# Altium project PCB_Project.PrjPcb (part 4 of 4)

## Sheet USB.SchDoc
size 420 x 297 mm; Date: 22.03.2024; ApprovedBy: Arda B.; CheckedBy: Arda B.; DrawnBy: Arda Bozkurt; Revision: 001; SheetNumber: 9; SheetTotal: 9; Size: A3; Department: HDD; DOC_NO_ASSY_: __; Time: 22.03.2024
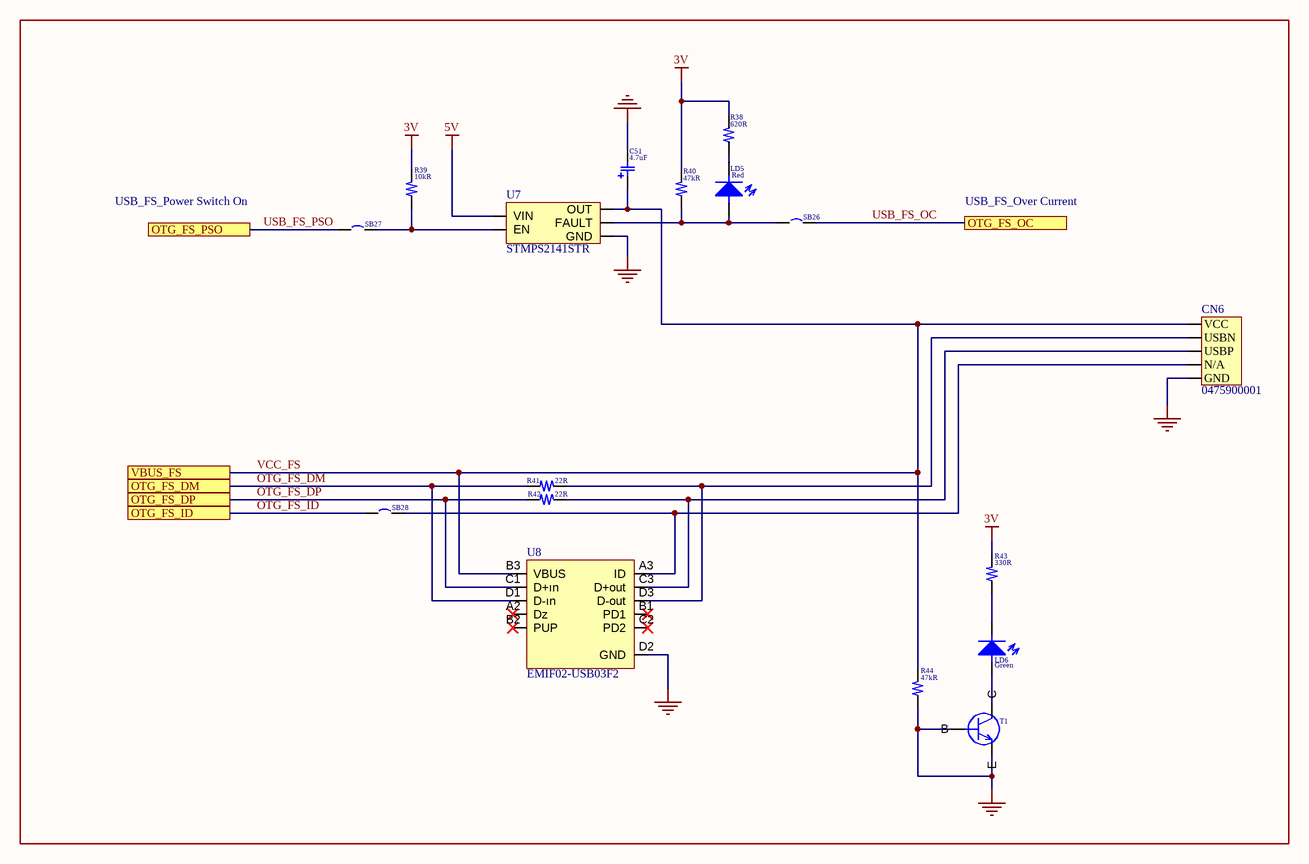
[diagram p8: USB.SchDoc]

### Parts
C51  value 4.7uF  [CAP-TANT]  (hidden comment: TCJK475M010R0300)
CN6  0475900001  [USB MİCRO A]
LD5  Color: Red  [LED-RED-0603]  (hidden comment: 150060RS75000)
LD6  Color: Green  [LED-GREEN-0603]  (hidden comment: 150060VS75000)
R38  value 620R  [RES-0603]  (hidden comment: RC0603FR-07620RL)
R39  value 10kR  [RES-0402]  (hidden comment: RC0402FR-0710KL)
R40  value 47kR  [RES-0402]  (hidden comment: RC0402FR-0747KL)
R41  value 22R  [RES-0603]  (hidden comment: RC0603FR-0722RL)
R42  value 22R  [RES-0603]  (hidden comment: RC0603FR-0722RL)
R43  value 330R  [RES-0402]  (hidden comment: RC0402FR-07330RL)
R44  value 47kR  [RES-0402]  (hidden comment: RC0402FR-0747KL)
SB26  RC0402JR-070RL  [RES-0402]  (value not drawn)
SB27  RC0402JR-070RL  [RES-0402]  (value not drawn)
SB28  RC0402JR-070RL  [RES-0402]  (value not drawn)
T1  MMBT2222ALT1G  [SOT23-3]  (value not drawn)
U7  STMPS2141STR  [SOT23-5L]
U8  EMIF02-USB03F2  [Flip-Chip-11]

### Ports
OTG_FS_DM (see TOP[5B], Micro Controller[5B]), OTG_FS_DP (see TOP[5B], Micro Controller[5B]), OTG_FS_ID (see TOP[5B], Micro Controller[5B]), OTG_FS_OC (see TOP[6B], Micro Controller[5B]), OTG_FS_PSO (see TOP[6B], Micro Controller[5B]), VBUS_FS (see TOP[5B], Micro Controller[5B])

### Nets
3V: R38.2 R39.2 R40.2 R43.2
5V: U7.5(VIN)
GND: C51.2 CN6.5(GND) R44.1 T1.1(B) T1.2(E) U7.2(GND) U8.D2(GND)
OTG_FS_DM: R41.1 U8.D1(D-ın) ; port OTG_FS_DM
OTG_FS_DP: R42.1 U8.C1(D+ın) ; port OTG_FS_DP
OTG_FS_ID: SB28.1 ; port OTG_FS_ID
USB_FS_OC: SB26.2 ; port OTG_FS_OC  [project net OTG_FS_OC]
USB_FS_PSO: SB27.1 ; port OTG_FS_PSO  [project net OTG_FS_PSO]
VCC_FS: C51.1 CN6.1(VCC) R44.2 U7.1(OUT) U8.B3(VBUS) ; port VBUS_FS  [project net PB13]
NetCN6_2: CN6.2(USBN) R41.2 U8.D3(D-out)
NetCN6_3: CN6.3(USBP) R42.2 U8.C3(D+out)
NetCN6_4: CN6.4(N/A) SB28.2 U8.A3(ID)
NetLD5_1: LD5.1 R38.1
NetLD5_2: LD5.2 R40.1 SB26.1 U7.3(FAULT)
NetLD6_1: LD6.1 R43.1
NetLD6_2: LD6.2 T1.3(C)
NetR39_1: R39.1 SB27.2 U7.4(EN)

Not connected (* = marked no-connect by the designer): U8 A2(Dz)* B1(PD1)* B2(PUP)* C2(PD2)*

### Notes on the sheet
- USB_FS_Power Switch On
- USB_FS_Over Current
- REVİSİON
- DESCRIPTION
- DATE
- APPROVED
- DWG NO:
- TAINIM/DESCRIPTION
- REV:
- DOSYA ADI/FİLE NAME
- HAZIRLAYAN/PREPARED BY
- KONTROL EDEN/ CHECKED BY
- YAYIN TARİHİ/REL. DATE
- DEĞ TARİHİ/CHANCE DATE
- ONAYLAYAN/APPROVED BY
- REVİZYON/REVISION
- Arda Bozkurt
- BÖLÜM/DEPARTMENT
- BOYUT/SİZE
- SAYFA/SHEET
- of

### Library data of the parts
C51 = C-TANT POLY 4.7UF 10V 1206: Cap Tant Polymer 4.7uF 10V K CASE 20% (3.2 x 1.6 x 1mm) SMD 300m Ohm 105°C T/R; Manufacturer: Kyocera AVX; Manufacturer Part Number: TCJK475M010R0300E; Supplier: Avnet; Supplier Part Number: TCJK475M010R0300E; RoHS: Yes; Pricing: 3000=0,72395 (USD)
CN6 = CONN USB MİCRO A 5P: USB Connector, 5 Contact(s), Female, Right Angle, Surface Mount Terminal, Locking, Receptacle; Manufacturer: Molex; Manufacturer Part Number: 47590-0001; Plating: 157ConductorMaterial; Supplier: Mouser; Supplier Part Number: 538-47590-0001; RoHS: Yes; Category: USB Connectors; Stock: 13739; Pricing: 1=0,79, 10=0,699, 50=0,699, 100=0,582, 1000=0,53, 10000=0,421 (USD)
LD5 = LED RED CLEAR 0603 SMD: LED Low-Power Uni-Color Red 630nm 2V 2-Pin Chip 0603(1608Metric) T/R; Manufacturer: Wurth Electronics; Lens Color: Colorless; Viewing Angle: 140°; Lens Style: Clear,Flat,Rectangular; Luminous Intensity: 250mcd; Forward Current: 30mA; Wavelength: 625nm; Test Current: 20mA; Lens Transparency: Clear; Max Reverse Voltage (DC): 5V; Power Dissipation: 72mW; Lens Size: 0.7mm; Supplier: Farnell; Supplier Part Number: 2322071; Manufacturer Part Number: 150060RS75000; RoHS: Yes; Category: LEDs; Stock: 28909; Pricing: 5=0,164, 10=0,147, 100=0,121, 500=0,11, 1000=0,108 (EUR); Mounting Technology: Surface Mount; Case/Package: 0603; Case Code (Metric): 1608; Case Code (Imperial): 0603; Min Operating Temperature: -40°C; Max Operating Temperature: 85°C; Package Quantity: 1; Packaging: Cut Tape; Forward Voltage: 2V; Dominant Wavelength: 625nm; Series: WL-SMCW; Reverse Voltage: 5V; Length: 1.6mm; Width: 0.8mm; Height: 0.8mm; RoHS Compliant: Yes; Reach SVHC Compliant: Unknown; ComponentLink1URL: https://datasheet.ciiva.com/29563/150060rs75000-29563040.pdf?src-supplier=Digikey; ComponentLink1Description: https://datasheet.ciiva.com/29563/150060rs75000-29563040.pdf?src-supplier=Digikey; ComponentLink2URL: https://datasheet.ciiva.com/29279/759428-da-01-en-chipled-0603-w-kl-rot-150060rs75000-29279196.pdf?src-supplier=Conrad; ComponentLink2Description: https://datasheet.ciiva.com/29279/759428-da-01-en-chipled-0603-w-kl-rot-150060rs75000-29279196.pdf?src-supplier=Conrad
LD6 = LED GREEN CLEAR 0603 SMD: WURTH ELEKTRONIK - 150060VS75000 - LED, Green, SMD, 0603, 30 mA, 2 V, 570 nm; Manufacturer: Wurth Electronics; Lens Color: Colorless; Luminous Intensity: 40mcd; Viewing Angle: 140°; Forward Voltage: 2V; Lens Style: Rectangular,Flat; Forward Current: 20mA; Dominant Wavelength: 570nm; Lens Transparency: Clear; Power Rating: 72mW; Reverse Voltage (DC): 5V; Lens Size: 0.7mm; Supplier: Farnell; Supplier Part Number: 2322073; Manufacturer Part Number: 150060VS75000; RoHS: Yes; Category: LEDs; Stock: 2968; Pricing: 5=0,164, 10=0,147, 100=0,121, 500=0,11, 1000=0,108 (EUR); Mounting Technology: Surface Mount; Case/Package: 0603; Pins: 2; Case Code (Metric): 1608; Case Code (Imperial): 0603; Weight: 0.000882oz; Min Operating Temperature: -40°C; Max Operating Temperature: 85°C; Package Quantity: 4000; Packaging: Cut Tape; Test Current: 20mA; Illumination Color: Green; Series: WL-SMCW; Max Reverse Voltage (DC): 5V; Power Dissipation: 72mW; Reverse Voltage: 5V; Length: 1.6mm; Width: 0.8mm; Height: 0.8mm; RoHS Compliant: Yes; Reach SVHC Compliant: 4187SVHC; ComponentLink1URL: https://datasheet.ciiva.com/29562/150060vs75000-29562919.pdf?src-supplier=Digikey; ComponentLink1Description: https://datasheet.ciiva.com/29562/150060vs75000-29562919.pdf?src-supplier=Digikey
R38 = RES 620 OHM 1% 1/10W 0603: SMD Chip Resistor, 620 Ohm, ± 1%, 100 mW, 0603 [1608 Metric], Thick Film, General Purpose; Manufacturer: Yageo; Supplier: Future Electronics; Supplier Part Number: 6944821; Manufacturer Part Number: RC0603FR-07620RL; RoHS: Yes; Category: Chip SMD Resistors; Stock: 330000; Pricing: 5000=0,0015, 50000=0,0014, 150000=0,0014, 375000=0,0013, 1000000=0,0012 (USD); ComponentLink1URL: http://www.mouser.com/ds/2/447/RC0603-272842.pdf?src-supplier=Mouser; ComponentLink1Description: http://www.mouser.com/ds/2/447/RC0603-272842.pdf?src-supplier=Mouser; ComponentLink2URL: http://www.yageo.com/documents/recent/PYu-RC_Group_51_RoHS_L_9.pdf?src-supplier=Digikey; ComponentLink2Description: http://www.yageo.com/documents/recent/PYu-RC_Group_51_RoHS_L_9.pdf?src-supplier=Digikey; ComponentLink3URL: http://www.yageo.com/documents/recent/PYu-RC_Group_51_RoHS_L_10.pdf?src-supplier=Digikey; ComponentLink3Description: http://www.yageo.com/documents/recent/PYu-RC_Group_51_RoHS_L_10.pdf?src-supplier=Digikey; ComponentLink4URL: https://datasheet.octopart.com/RC0603FR-07620RL-Yageo-datasheet-164759695.pdf?src-supplier=Future+Electronics; ComponentLink4Description: https://datasheet.octopart.com/RC0603FR-07620RL-Yageo-datasheet-164759695.pdf?src-supplier=Future+Electronics; ComponentLink5URL: http://www.yageo.com/documents/recent/PYu-RC0603_51_RoHS_L_7.pdf?src-supplier=Future+Electronics; ComponentLink5Description: http://www.yageo.com/documents/recent/PYu-RC0603_51_RoHS_L_7.pdf?src-supplier=Future+Electronics; ComponentLink6URL: https://datasheet.octopart.com/RC0603FR-07620RL-Yageo-datasheet-148775077.pdf?src-supplier=TME; ComponentLink6Description: https://datasheet.octopart.com/RC0603FR-07620RL-Yageo-datasheet-148775077.pdf?src-supplier=TME
R39 = RES 10K OHM 1% 1/16W 0402: SMD Chip Resistor, 10 kOhm, ± 1%, 63 mW, 0402 [1005 Metric], Thick Film, General Purpose; Manufacturer: Yageo; Voltage Rating (DC): 50V; Temperature Coefficient: 100ppm/°C; Power Rating: 62.5mW; Max Power Dissipation: 63mW; Supplier: Future Electronics; Supplier Part Number: 3388022; Manufacturer Part Number: RC0402FR-0710KL; RoHS: Yes; Category: Chip SMD Resistors; Stock: 56000000; Pricing: 10000=0,0012, 100000=0,0011, 300000=0,001, 750000=0,001, 2000000=0,0009 (USD); Case/Package: 0402; Pins: 2; Case Code (Imperial): 0402; Case Code (Metric): 1005; Min Operating Temperature: -55°C; Max Operating Temperature: 155°C; Resistor Type: Thick Film; Voltage Rating: 50V; Tolerance: 1%; Packaging: Tape and Reel; Termination: SMD/SMT; Series: RC; Number of Terminations: 2; Features: Moisture Resistant; Resistance Tolerance: 1%; Construction: Rectangular; Length: 1mm; Width: 0.5mm; Depth: 0.5mm; Lead Pitch: 0.2mm; RoHS Compliant: Yes; Reach SVHC Compliant: Unknown; Lead Free: 5697LeadFree; Military Standard: Not; ComponentLink1URL: https://datasheet.ciiva.com/7660/38568-7660787.pdf?src-supplier=Element14; ComponentLink1Description: https://datasheet.ciiva.com/7660/38568-7660787.pdf?src-supplier=Element14; ComponentLink2URL: https://datasheet.ciiva.com/7849/1686128-7849814.pdf?src-supplier=Element14; ComponentLink2Description: https://datasheet.ciiva.com/7849/1686128-7849814.pdf?src-supplier=Element14; ComponentLink3URL: https://datasheet.ciiva.com/7983/1018594-7983486.pdf?src-supplier=Element14; ComponentLink3Description: https://datasheet.ciiva.com/7983/1018594-7983486.pdf?src-supplier=Element14
R40 R44 = RES 47K OHM 1% 1/16W 0402: SMD Chip Resistor, 47 kOhm, ± 1%, 63 mW, 0402 [1005 Metric], Thick Film, General Purpose; Manufacturer: Yageo; Power Rating: 62.5mW; Temperature Coefficient: 100ppm/°C; Voltage Rating: 50V; Max Power Dissipation: 63mW; Supplier: Future Electronics; Supplier Part Number: 6020820; Manufacturer Part Number: RC0402FR-0747KL; RoHS: Yes; Category: Chip SMD Resistors; Stock: 1220000; Pricing: 10000=0,0019, 100000=0,0011, 200000=0,0018, 300000=0,001, 750000=0,0017, 2000000=0,0017, 7500000=0,0015 (USD); Case/Package: 0402; Case Code (Imperial): 0402; Case Code (Metric): 1005; Min Operating Temperature: -55°C; Max Operating Temperature: 155°C; Tolerance: 1%; Series: RC; Packaging: Tape and Reel; Package Quantity: 1; Termination: SMD/SMT; Resistor Type: Thick Film; Number of Terminations: 2; Features: Moisture Resistant; Resistance Tolerance: 1%; Construction: Rectangular; Voltage Rating (AC): 50V; Length: 1mm; Width: 0.02inch; Height: 0.016inch; Depth: 0.5mm; RoHS Compliant: Yes; Military Standard: Not; Reach SVHC Compliant: Unknown; Lead Free: 5697LeadFree; ComponentLink1URL: https://datasheet.ciiva.com/46412/1018594-46412839.pdf?src-supplier=Element14; ComponentLink1Description: https://datasheet.ciiva.com/46412/1018594-46412839.pdf?src-supplier=Element14; ComponentLink2URL: https://datasheet.ciiva.com/2453/pyu-r-int-thick-7-2453389.pdf?src-supplier=Digikey; ComponentLink2Description: https://datasheet.ciiva.com/2453/pyu-r-int-thick-7-2453389.pdf?src-supplier=Digikey; ComponentLink3URL: https://datasheet.ciiva.com/2453/pyu-r-int-thick-7-2453390.pdf?src-supplier=Digikey; ComponentLink3Description: https://datasheet.ciiva.com/2453/pyu-r-int-thick-7-2453390.pdf?src-supplier=Digikey; ComponentLink4URL: https://datasheet.ciiva.com/2453/pyu-r-int-thick-7-2453388.pdf?src-supplier=Digikey; ComponentLink4Description: https://datasheet.ciiva.com/2453/pyu-r-int-thick-7-2453388.pdf?src-supplier=Digikey; ComponentLink5URL: https://datasheet.ciiva.com/15189/getdatasheetpartid-323748-15189466.pdf?src-supplier=Verical; ComponentLink5Description: https://datasheet.ciiva.com/15189/getdatasheetpartid-323748-15189466.pdf?src-supplier=Verical; ComponentLink6URL: https://datasheet.ciiva.com/16793/pyu-rc0402-51-rohs-l-6-r-16793430.pdf?src-supplier=Future+Electronics; ComponentLink6Description: https://datasheet.ciiva.com/16793/pyu-rc0402-51-rohs-l-6-r-16793430.pdf?src-supplier=Future+Electronics
R41 R42 = RES 22 OHM 1% 1/10W 0603: SMD Chip Resistor, 22 Ohm, ± 1%, 100 mW, 0603 [1608 Metric], Thick Film, General Purpose; Manufacturer: Yageo; Temperature Coefficient: 100ppm/°C; Voltage Rating (DC): 50V; Power Rating: 100mW; Output Current: 8A; Min Input Voltage: 1.4V; Supplier: Future Electronics; Supplier Part Number: 8636706; Manufacturer Part Number: RC0603FR-0722RL; RoHS: Yes; Category: Chip SMD Resistors; Stock: 2215000; Pricing: 5000=0,0015, 50000=0,0014, 150000=0,0014, 375000=0,0013, 1000000=0,0012 (USD); Case/Package: 0603; Pins: 2; Case Code (Metric): 1608; Case Code (Imperial): 0603; Min Operating Temperature: -55°C; Max Operating Temperature: 155°C; Tolerance: 1%; Resistor Type: Thick Film; Packaging: Tape and Reel; Voltage Rating: 50V; Package Quantity: 1; Number of Terminations: 2; Termination: SMD/SMT; Max Power Dissipation: 100mW; Features: Moisture Resistant; Series: RC; Resistance Tolerance: 1%; Technology: THICK FILM; Construction: Rectangular; Voltage Rating (AC): 50V; Max Output current: 8A; Length: 0.063inch; Width: 0.031inch; Height: 0.022inch; Depth: 0.8mm; Radiation Hardening: 5898YesNo; Reach SVHC Compliant: No; Lead Free: 5697LeadFree; Military Standard: Not; RoHS Compliant: Yes; ComponentLink1URL: https://datasheet.ciiva.com/11819/0900766b80f96399-11819285.pdf?src-supplier=Rs; ComponentLink1Description: https://datasheet.ciiva.com/11819/0900766b80f96399-11819285.pdf?src-supplier=Rs; ComponentLink2URL: https://datasheet.ciiva.com/46395/443971-46395032.pdf?src-supplier=Element14; ComponentLink2Description: https://datasheet.ciiva.com/46395/443971-46395032.pdf?src-supplier=Element14; ComponentLink3URL: https://datasheet.ciiva.com/46440/1868787-46440901.pdf?src-supplier=Element14; ComponentLink3Description: https://datasheet.ciiva.com/46440/1868787-46440901.pdf?src-supplier=Element14; ComponentLink4URL: https://datasheet.ciiva.com/2454/pyu-r-int-thick-7-2454355.pdf?src-supplier=Digikey; ComponentLink4Description: https://datasheet.ciiva.com/2454/pyu-r-int-thick-7-2454355.pdf?src-supplier=Digikey; ComponentLink5URL: https://datasheet.ciiva.com/2454/pyu-r-int-thick-7-2454356.pdf?src-supplier=Digikey; ComponentLink5Description: https://datasheet.ciiva.com/2454/pyu-r-int-thick-7-2454356.pdf?src-supplier=Digikey; ComponentLink6URL: https://datasheet.ciiva.com/2454/pyu-r-int-thick-7-2454354.pdf?src-supplier=Digikey; ComponentLink6Description: https://datasheet.ciiva.com/2454/pyu-r-int-thick-7-2454354.pdf?src-supplier=Digikey
R43 = RES 330 OHM 1% 1/16W 0402: SMD Chip Resistor, 330 Ohm, ± 1%, 63 mW, 0402 [1005 Metric], Thick Film, General Purpose; Manufacturer: Yageo; Temperature Coefficient: 100ppm/°C; Power Rating: 62.5mW; Voltage Rating: 50V; Max Power Dissipation: 63mW; Supplier: Future Electronics; Supplier Part Number: 7045693; Manufacturer Part Number: RC0402FR-07330RL; RoHS: Yes; Category: Chip SMD Resistors; Stock: 1480000; Pricing: 10000=0,002, 100000=0,0011, 200000=0,0019, 300000=0,001, 750000=0,0018, 2000000=0,0018, 7500000=0,0016 (USD); Case/Package: 0402; Case Code (Metric): 1005; Case Code (Imperial): 0402; Min Operating Temperature: -55°C; Max Operating Temperature: 155°C; Packaging: Tape and Reel; Tolerance: 1%; Package Quantity: 1; Resistor Type: Thick Film; Number of Terminations: 2; Termination: SMD/SMT; Features: Moisture Resistant; Series: RC; Construction: Rectangular; Technology: THICK FILM; Resistance Tolerance: 1%; Voltage Rating (AC): 50V; Length: 0.039inch; Width: 0.02inch; Height: 0.016inch; Depth: 0.5mm; RoHS Compliant: Yes; Reach SVHC Compliant: No; Military Standard: Not; Lead Free: 5697LeadFree; ComponentLink1URL: https://datasheet.ciiva.com/11819/0900766b80c66297-11819490.pdf?src-supplier=Rs; ComponentLink1Description: https://datasheet.ciiva.com/11819/0900766b80c66297-11819490.pdf?src-supplier=Rs; ComponentLink2URL: https://datasheet.ciiva.com/2453/pyu-r-int-thick-7-2453662.pdf?src-supplier=Digikey; ComponentLink2Description: https://datasheet.ciiva.com/2453/pyu-r-int-thick-7-2453662.pdf?src-supplier=Digikey; ComponentLink3URL: https://datasheet.ciiva.com/2453/pyu-r-int-thick-7-2453663.pdf?src-supplier=Digikey; ComponentLink3Description: https://datasheet.ciiva.com/2453/pyu-r-int-thick-7-2453663.pdf?src-supplier=Digikey; ComponentLink4URL: https://datasheet.ciiva.com/2453/pyu-r-int-thick-7-2453661.pdf?src-supplier=Digikey; ComponentLink4Description: https://datasheet.ciiva.com/2453/pyu-r-int-thick-7-2453661.pdf?src-supplier=Digikey; ComponentLink5URL: https://datasheet.ciiva.com/12656/pyu-rc0402-51-rohs-l-6-r-12656815.pdf?src-supplier=Mouser; ComponentLink5Description: https://datasheet.ciiva.com/12656/pyu-rc0402-51-rohs-l-6-r-12656815.pdf?src-supplier=Mouser; ComponentLink6URL: https://datasheet.ciiva.com/7849/1018594-7849963.pdf?src-supplier=Element14; ComponentLink6Description: https://datasheet.ciiva.com/7849/1018594-7849963.pdf?src-supplier=Element14; ComponentLink7URL: https://datasheet.ciiva.com/7849/1018594-7849962.pdf?src-supplier=Element14; ComponentLink7Description: https://datasheet.ciiva.com/7849/1018594-7849962.pdf?src-supplier=Element14; ComponentLink8URL: https://datasheet.ciiva.com/17083/pyu-rc0402-51-rohs-l-6-r-17083994.pdf?src-supplier=Future+Electronics; ComponentLink8Description: https://datasheet.ciiva.com/17083/pyu-rc0402-51-rohs-l-6-r-17083994.pdf?src-supplier=Future+Electronics
SB26-SB28 = RES 0 OHM JUMPER 1/10W 0603: Zero Ohm Resistor, Jumper, 0402 [1005 Metric], Thick Film, 62.5 mW, 1 A, Surface Mount; Manufacturer: Yageo; Manufacturer Part Number: RC0603JR-070RL; Tolerance: 1%; Power Rating: 100mW; Voltage Rating (DC): 50V; Temperature Coefficient: 200ppm/°C; Resistance Tolerance: 5%; Value: 0mR; Supplier: Future Electronics; Supplier Part Number: 3992146; RoHS: Yes; Category: Chip SMD Resistors; Stock: 16200000; Pricing: 5000=0,0016, 50000=0,0014, 100000=0,0015, 150000=0,0014, 375000=0,0014, 1000000=0,0012, 1250000=0,0013, 5000000=0,0012 (USD); Case/Package: 0603; Pins: 2; Contact Plating: Tin,Matte; Case Code (Imperial): 0402; Case Code (Metric): 1608; Min Operating Temperature: -55°C; Max Operating Temperature: 155°C; Resistor Type: Thick Film; Packaging: Tape and Reel; Termination: SMD/SMT; Series: RC; Technology: THICK FILM; Package Quantity: 5000; Voltage Rating: 50V; Features: Moisture Resistant; Max Power Dissipation: 100mW; Number of Terminations: 2; Construction: Rectangular; Length: 1.6mm; Width: 0.8mm; Height: 0.45mm; Depth: 0.8mm; RoHS Compliant: Yes; Reach SVHC Compliant: Unknown; Lead Free: 5697LeadFree; Military Standard: Not
T1 = TRANS NPN 40V 0.6A SOT23-3: Bipolar (BJT) Transistor NPN 40V 600mA 300MHz 225mW Surface Mount SOT-23-3; Manufacturer: ON Semiconductor; Power Dissipation: 300mW; hFE Min: 100; Number of Elements: 1; Collector Base Voltage (VCBO): 75V; Emitter Base Voltage (VEBO): 6V; Collector Emitter Saturation Voltage: 1V; Type: General Purpose; Supplier: Avnet; Supplier Part Number: MMBT2222ALT1G; Manufacturer Part Number: MMBT2222ALT1G; RoHS: Yes; Category: BJTs; Stock: 4183500; Pricing: 14706=0,05032, 15000=0,04896, 30000=0,0476, 74000=0,04624, 150000=0,04488, 740000=0,04352, 1500000=0,04216 (USD); Case/Package: SOT-23-3; Pins: 3; Min Operating Temperature: -55°C; Max Operating Temperature: 150°C; Packaging: Tape and Reel; Polarity: NPN; Voltage Rating (DC): 40V; Current Rating: 600mA; Max Power Dissipation: 225mW; Package Quantity: 3000; Frequency: 300MHz; Collector Emitter Voltage (VCEO): 40V; Max Collector Current: 600mA; Collector Emitter Breakdown Voltage: 40V; Transition Frequency: 300MHz; Max Breakdown Voltage: 40V; Clock Frequency: 300MHz; Gain Bandwidth Product: 300MHz; Collector-emitter Voltage-Max: 1V; Series: Automotive, AEC-Q101; Length: 2.9mm; Width: 1.3mm; Height: 0.94mm; Radiation Hardening: No; Reach SVHC Compliant: No; Lead Free: Lead Free; RoHS Compliant: Yes; ComponentLink1URL: https://datasheet.ciiva.com/16199/mmbt2222lt1-d-16199072.pdf?src-supplier=Future+Electronics; ComponentLink1Description: https://datasheet.ciiva.com/16199/mmbt2222lt1-d-16199072.pdf?src-supplier=Future+Electronics; ComponentLink2URL: https://datasheet.ciiva.com/15139/getdatasheetpartid-82691-15139077.pdf?src-supplier=Verical; ComponentLink2Description: https://datasheet.ciiva.com/15139/getdatasheetpartid-82691-15139077.pdf?src-supplier=Verical; ComponentLink3URL: https://datasheet.ciiva.com/7972/mmbt2222lt1-d-7972057.pdf?src-supplier=Element14; ComponentLink3Description: https://datasheet.ciiva.com/7972/mmbt2222lt1-d-7972057.pdf?src-supplier=Element14; ComponentLink4URL: https://datasheet.ciiva.com/7972/mmbt2222lt1-d-7972058.pdf?src-supplier=Element14; ComponentLink4Description: https://datasheet.ciiva.com/7972/mmbt2222lt1-d-7972058.pdf?src-supplier=Element14; ComponentLink5URL: https://datasheet.ciiva.com/14546/70099528-14546715.pdf?src-supplier=Allied+Electronics; ComponentLink5Description: https://datasheet.ciiva.com/14546/70099528-14546715.pdf?src-supplier=Allied+Electronics; ComponentLink6URL: https://datasheet.ciiva.com/11201/mmbt2222lt1-d-11201869.pdf?src-supplier=Avnet; ComponentLink6Description: https://datasheet.ciiva.com/11201/mmbt2222lt1-d-11201869.pdf?src-supplier=Avnet; ComponentLink7URL: https://datasheet.ciiva.com/976/mmbt2222lt1-d-976345.pdf?src-supplier=Digikey; ComponentLink7Description: https://datasheet.ciiva.com/976/mmbt2222lt1-d-976345.pdf?src-supplier=Digikey; ComponentLink8URL: https://datasheet.ciiva.com/976/mmbt2222lt1-d-976346.pdf?src-supplier=Digikey; ComponentLink8Description: https://datasheet.ciiva.com/976/mmbt2222lt1-d-976346.pdf?src-supplier=Digikey; ComponentLink9URL: https://datasheet.ciiva.com/976/mmbt2222lt1-d-976344.pdf?src-supplier=Digikey; ComponentLink9Description: https://datasheet.ciiva.com/976/mmbt2222lt1-d-976344.pdf?src-supplier=Digikey
U7 = IC PWR SWITCH N-CHAN 1:1 SOT23-5: STMPS Series 1 Channel 5.5 V 500 mA 200 mOhm High Side Power Switch - SOT-23-5; Manufacturer: STMicroelectronics; Drain to Source Resistance: 90mR; Max Supply Voltage: 5.5V; Min Supply Voltage: 2.7V; Nominal Supply Voltage: 5V; Number of Channels: 1NUMBER; Value: 120mR; Supplier: Mouser; Supplier Part Number: 511-STMPS2141STR; Manufacturer Part Number: STMPS2141STR; RoHS: Yes; Category: Hot Swap Controllers; Stock: 65022; Pricing: 1=1,32, 10=1,18, 50=1,08, 100=0,91, 1000=0,562, 10000=0,497 (USD); Output Voltage: 5V; ComponentLink1URL: https://datasheet.ciiva.com/15108/getdatasheetpartid-160072-15108990.pdf?src-supplier=Verical; ComponentLink1Description: https://datasheet.ciiva.com/15108/getdatasheetpartid-160072-15108990.pdf?src-supplier=Verical; ComponentLink2URL: https://datasheet.ciiva.com/4923/cd00167470-4923447.pdf?src-supplier=Mouser; ComponentLink2Description: https://datasheet.ciiva.com/4923/cd00167470-4923447.pdf?src-supplier=Mouser; ComponentLink3URL: https://datasheet.ciiva.com/1962/cd00167470-1962472.pdf?src-supplier=Digikey; ComponentLink3Description: https://datasheet.ciiva.com/1962/cd00167470-1962472.pdf?src-supplier=Digikey; ComponentLink4URL: https://datasheet.ciiva.com/1962/cd00167470-1962473.pdf?src-supplier=Digikey; ComponentLink4Description: https://datasheet.ciiva.com/1962/cd00167470-1962473.pdf?src-supplier=Digikey; ComponentLink5URL: https://datasheet.ciiva.com/1962/cd00167470-1962474.pdf?src-supplier=Digikey; ComponentLink5Description: https://datasheet.ciiva.com/1962/cd00167470-1962474.pdf?src-supplier=Digikey; ComponentLink6URL: https://datasheet.ciiva.com/16491/cd00167470-16491245.pdf?src-supplier=Future+Electronics; ComponentLink6Description: https://datasheet.ciiva.com/16491/cd00167470-16491245.pdf?src-supplier=Future+Electronics
U8 = FILTER RC(PI) 33 OHM/20PF SMD: 2-line EMI filter and ESD protection with R pull-up for USB interfaces; Manufacturer: STMicroelectronics; Supplier: Mouser; Supplier Part Number: 511-EMIF02-USB03F2; Manufacturer Part Number: EMIF02-USB03F2; RoHS: Yes; Category: EMI / RFI Components; Stock: 31970; Pricing: 1=0,45, 10=0,436, 50=0,344, 100=0,319, 1000=0,263, 10000=0,244 (USD); ComponentLink1URL: https://datasheet.ciiva.com/12394/cd00042880-211729-12394966.pdf?src-supplier=Mouser; ComponentLink1Description: https://datasheet.ciiva.com/12394/cd00042880-211729-12394966.pdf?src-supplier=Mouser; ComponentLink2URL: https://datasheet.ciiva.com/3068/cd00042880-3068450.pdf?src-supplier=Avnet; ComponentLink2Description: https://datasheet.ciiva.com/3068/cd00042880-3068450.pdf?src-supplier=Avnet

## Nets that join several sheets
3V: TOP (P2.1 P2.2), SDRAM (14 pins), ST-LINK (19 pins), LCD (14 pins), MEMS Motion Sensor (6 pins), USB (R38.2 R39.2 R40.2 R43.2)
5V: TOP (P1.1 P1.2), MEMS Motion Sensor (CN5.8), USB (U7.5)
GND: TOP (6 pins), Micro Controller (31 pins), SDRAM (14 pins), ST-LINK (35 pins), LCD (14 pins), MEMS Motion Sensor (20 pins), USB (7 pins)
VDD: TOP (P1.22), Micro Controller (29 pins), ST-LINK (D2.1 JP3.2), LCD (R21.1 R22.1 R23.1), MEMS Motion Sensor (B1.1 B1.4 R35.2 R36.2)
A0: Micro Controller (U1.10), SDRAM (U2.23)
A1: Micro Controller (U1.11), SDRAM (U2.24)
A2: Micro Controller (U1.12), SDRAM (U2.25)
A3: Micro Controller (U1.13), SDRAM (U2.26)
A4: Micro Controller (U1.14), SDRAM (U2.29)
A5: Micro Controller (U1.15), SDRAM (U2.30)
A6: Micro Controller (U1.50), SDRAM (U2.31)
A7: Micro Controller (U1.53), SDRAM (U2.32)
A8: Micro Controller (U1.54), SDRAM (U2.33)
A9: Micro Controller (U1.55), SDRAM (U2.34)
A10: Micro Controller (U1.56), SDRAM (U2.22)
A11: Micro Controller (U1.57), SDRAM (U2.35)
ACP_RST: Micro Controller (U1.43), MEMS Motion Sensor (CN5.4)
B2: Micro Controller (U1.122), LCD (CN4.29)
B3: Micro Controller (U1.126), LCD (CN4.28)
B4: Micro Controller (U1.127), LCD (CN4.27)
B5: Micro Controller (U1.37), LCD (CN4.26)
B6: Micro Controller (U1.139), LCD (CN4.25)
B7: Micro Controller (U1.140), LCD (CN4.24)
BA0: Micro Controller (U1.89), SDRAM (U2.20)
BA1: Micro Controller (U1.90), SDRAM (U2.21)
CSX: Micro Controller (U1.28), LCD (CN4.38)
D0: Micro Controller (U1.85), SDRAM (U2.2)
D1: Micro Controller (U1.86), SDRAM (U2.4)
D2: Micro Controller (U1.114), SDRAM (U2.5)
D3: Micro Controller (U1.115), SDRAM (U2.7)
D4: Micro Controller (U1.58), SDRAM (U2.8)
D5: Micro Controller (U1.59), SDRAM (U2.10)
D6: Micro Controller (U1.60), SDRAM (U2.11)
D7: Micro Controller (U1.63), SDRAM (U2.13)
D8: Micro Controller (U1.64), SDRAM (U2.42)
D9: Micro Controller (U1.65), SDRAM (U2.44)
D10: Micro Controller (U1.66), SDRAM (U2.45)
D11: Micro Controller (U1.67), SDRAM (U2.47)
D12: Micro Controller (U1.68), SDRAM (U2.48)
D13: Micro Controller (U1.77), SDRAM (U2.50)
D14: Micro Controller (U1.78), SDRAM (U2.51)
D15: Micro Controller (U1.79), SDRAM (U2.53)
DCX_SCL: Micro Controller (U1.19), LCD (CN4.37), MEMS Motion Sensor (U6.2)
DOTCLK: Micro Controller (U1.92), LCD (CN4.31 R21.2)
ENABLE: Micro Controller (U1.22), LCD (CN4.32 R20.2)
G2: Micro Controller (U1.42), LCD (CN4.23)
G3: Micro Controller (U1.125), LCD (CN4.22)
G4: Micro Controller (U1.69), LCD (CN4.21)
G5: Micro Controller (U1.70), LCD (CN4.20)
G6: Micro Controller (U1.97), LCD (CN4.19)
G7: Micro Controller (U1.117), LCD (CN4.18)
HSYNC: Micro Controller (U1.96), LCD (CN4.33 R22.2)
I2C3_SCL: Micro Controller (U1.100), LCD (R24.1 U5.4), MEMS Motion Sensor (CN5.3)
I2C3_SDA: Micro Controller (U1.99), LCD (R25.1 U5.5), MEMS Motion Sensor (CN5.1)
IM0: Micro Controller (U1.116), LCD (CN4.40)
IM1: Micro Controller (U1.118), LCD (CN4.41)
IM2: Micro Controller (U1.119), LCD (CN4.42)
IM3: Micro Controller (U1.123), LCD (CN4.43)
MCO: Micro Controller (SB4.2 SB5.1 U1.23), ST-LINK (R9.2)
MEMS_INT1: Micro Controller (U1.35), MEMS Motion Sensor (U6.7)
MEMS_INT2: Micro Controller (U1.36), MEMS Motion Sensor (U6.6)
NBL0: Micro Controller (U1.141), SDRAM (U2.15)
NBL1: Micro Controller (U1.142), SDRAM (U2.39)
NCS_MEMS_SPI: Micro Controller (U1.27), MEMS Motion Sensor (U6.5)
NRST: Micro Controller (U1.25), ST-LINK (SB13.2), LCD (CN4.39), MEMS Motion Sensor (SB24.1)
OTG_FS_DM: Micro Controller (U1.75), USB (R41.1 U8.D1)
OTG_FS_DP: Micro Controller (U1.76), USB (R42.1 U8.C1)
OTG_FS_ID: Micro Controller (U1.73), USB (SB28.1)
OTG_FS_OC: Micro Controller (U1.45), USB (SB26.2)
OTG_FS_PSO: Micro Controller (U1.44), USB (SB27.1)
PA4: Micro Controller (U1.40), LCD (CN4.34 R23.2)
PA15: Micro Controller (U1.110), LCD (R26.1 U5.2)
PB5: Micro Controller (U1.135), SDRAM (U2.37)
PB6: Micro Controller (U1.136), SDRAM (U2.19)
PB13: Micro Controller (U1.74), USB (5 pins)
PC0: Micro Controller (U1.26), SDRAM (U2.16)
PD11: Micro Controller (U1.80), LCD (CN4.11)
PD12: Micro Controller (U1.81), LCD (CN4.35)
PD13: Micro Controller (U1.82), LCD (CN4.36)
PF8: Micro Controller (U1.20), MEMS Motion Sensor (U6.4)
PF9: Micro Controller (U1.21), LCD (CN4.30), MEMS Motion Sensor (U6.3)
PF11: Micro Controller (U1.49), SDRAM (U2.18)
PG8: Micro Controller (U1.93), SDRAM (U2.38)
PG15: Micro Controller (U1.132), SDRAM (U2.17)